# EAGLE design pg1 (EAGLE 4.16)
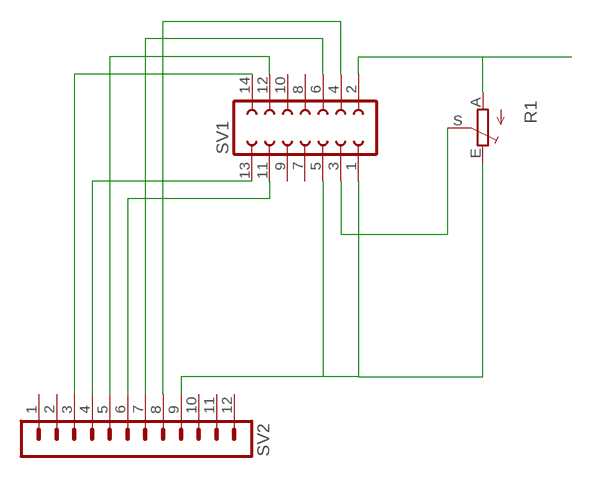
[diagram p0: schematic, sheet 1]

## Parts
R1  TRIM_EU-RJ6  [RJ6]
SV1  FE07-2  [FE07-2]
SV2  MA12-1  [MA12-1]

## Nets
JP6: R1.E SV1.1 SV1.5 SV2.9
N$2: R1.A SV1.2
N$3: R1.S SV1.3
N$4: SV1.4 SV2.8
N$6: SV1.6 SV2.7
N$7: SV1.11 SV2.6
N$8: SV1.12 SV2.5
N$9: SV1.13 SV2.4
N$10: SV1.14 SV2.3
Unconnected: SV1.7 SV1.8 SV1.9 SV1.10 SV2.1 SV2.2 SV2.10 SV2.11 SV2.12

## Library data of the parts
R1 = pot:TRIM_EU-: POTENTIOMETER
SV1 = con-lsta:FE07-2: FEMALE HEADER
SV2 = con-lstb:MA12-1: PIN HEADER

## Board
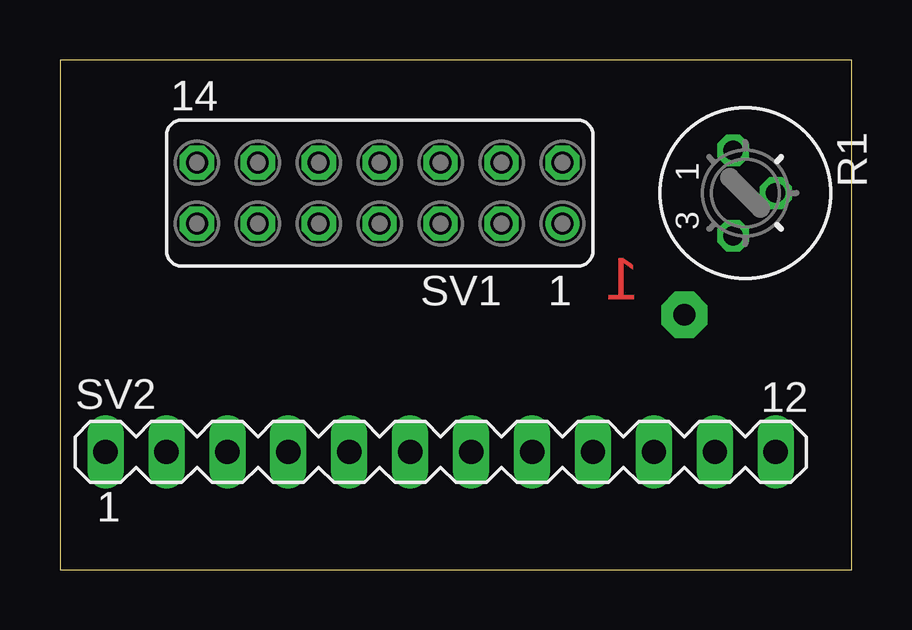
[diagram p1: board, top side]
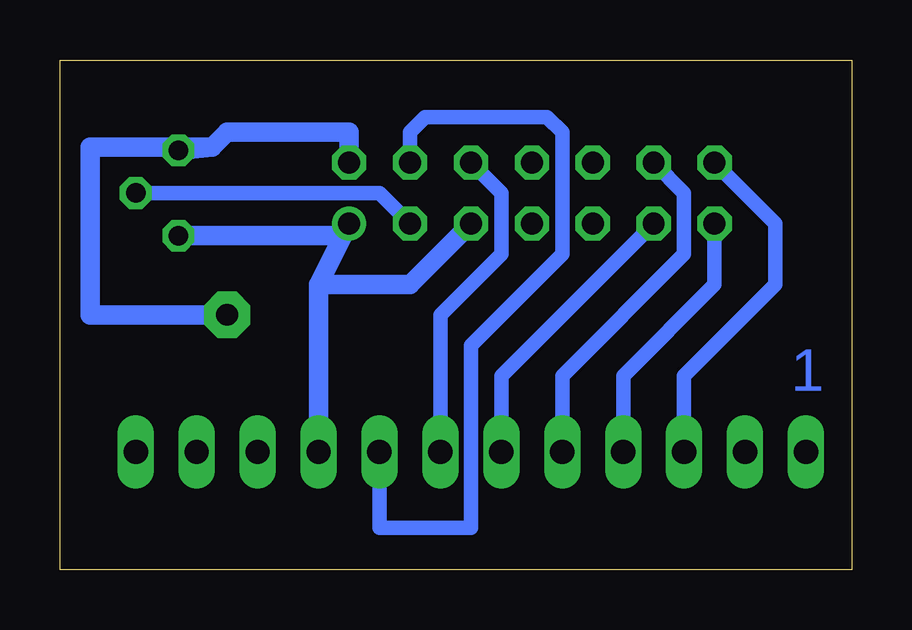
[diagram p2: board, bottom side, seen from below]

Size 33 x 21.26 mm. Coordinates in mm from the lower left corner, seen from the top.
Outline: 0,0 33,0 33,21.26 0,21.26 0,0
Copper layers (1*2+15*16): Top 0.035mm / dielectric 0.2mm / Route2 0.035mm / dielectric 0.15mm / Route15 0.035mm / dielectric 0.2mm / Bottom 0.035mm
Design rules "default": minimum track width 10mil, minimum drill 24mil, track to track 8mil, track to pad 8mil, pad to pad 8mil, via to via 8mil, smd to smd 8mil, copper to edge 40mil, drill to drill 8mil, minimum pad ring 10mil, minimum via ring 8mil, stop-mask expansion 4mil, vias tented up to drill 0mil, thermal gap 10mil

### Footprints (pad centres in the part's own frame; a part is rotated, then mirrored left to right if it is on the bottom)
RJ6 = drill 0.813 octagon: A -1.778,-0.508; E 1.778,-0.508; S 0,1.27
FE07-2 = drill 0.914 round: 1 -7.62,1.27 | drill 0.914 octagon: 2 -7.62,-1.27; 3 -5.08,1.27; 4 -5.08,-1.27; 5 -2.54,1.27; 6 -2.54,-1.27; 7 0,1.27; 8 0,-1.27; 9 2.54,1.27; 10 2.54,-1.27; 11 5.08,1.27; 12 5.08,-1.27; 13 7.62,1.27; 14 7.62,-1.27
MA12-1 = drill 1.016 long: 1 -13.97,0; 2 -11.43,0; 3 -8.89,0; 4 -6.35,0; 5 -3.81,0; 6 -1.27,0; 7 1.27,0; 8 3.81,0; 9 6.35,0; 10 8.89,0; 11 11.43,0; 12 13.97,0

### Placement (x,y rotation side)
R1  28.57,15.71 270 top
SV1  13.33,15.71 180 top
SV2  15.87,4.91 0 top

### Tracks (layer width: path | path; a pad name or v marks a point on that pad's centre or on a via)
JP6
  Bottom 0.61: 21.46,13.93 SV1.1
  Bottom 0.813: SV2.9 22.22,11.9 | SV1.5 18.41,11.9 22.22,11.9 | 22.22,11.9 SV1.1 | R1.E 21.46,13.93
N$2  (via drill 0.9 pad 1.93)
  Bottom 0.813: SV1.2 20.95,18.25 26.03,18.25 26.66,17.61 | 26.66,17.61 R1.A | 26.66,17.61 31.74,17.61 31.74,10.63 v26.03,10.63
N$3
  Bottom 0.61: SV1.3 19.68,15.71 R1.S
N$4
  Bottom 0.61: SV2.8 19.68,1.74 15.87,1.74 15.87,9.36 12.06,13.17 12.06,18.25 12.7,18.88 17.77,18.88 18.41,18.25 SV1.4
N$6
  Bottom 0.61: SV2.7 17.14,10.63 14.6,13.17 14.6,15.71 SV1.6
N$7
  Bottom 0.61: SV1.11 14.6,8.09 SV2.6
N$8
  Bottom 0.61: SV1.12 6.98,15.71 6.98,13.17 12.06,8.09 SV2.5
N$9
  Bottom 0.61: SV2.4 9.52,8.09 5.71,11.9 SV1.13
N$10
  Bottom 0.61: SV1.14 3.17,14.44 3.17,11.9 6.98,8.09 SV2.3

### Text on the board
Top: 1
Bottom: 1